# EAGLE design Adafruit TFT 2.8in Resistive Touchshield rev E (EAGLE 9.6.2)
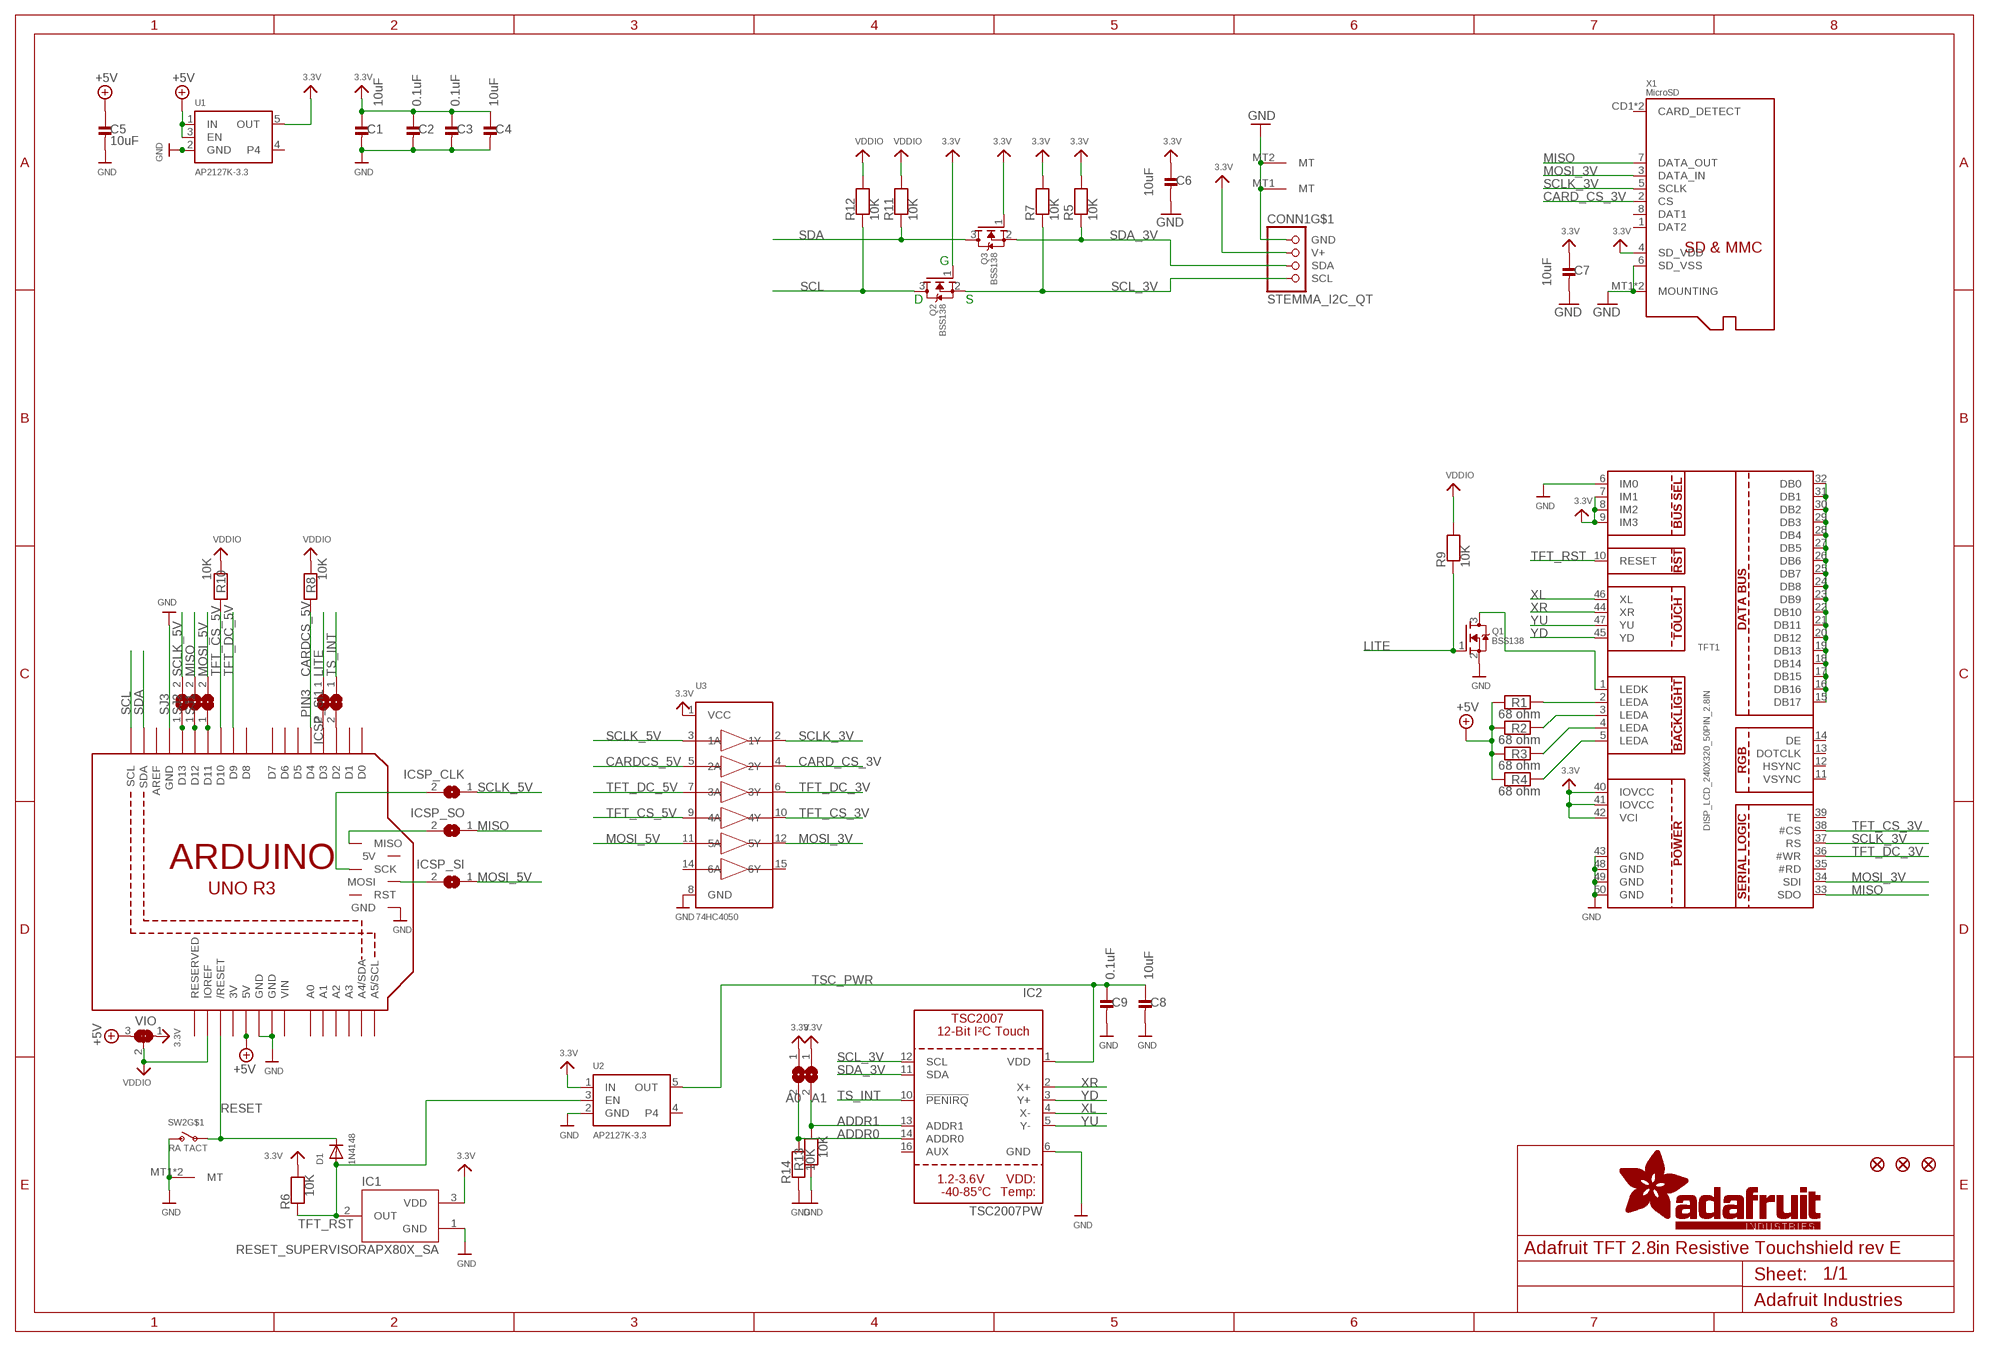
[diagram p0: schematic, sheet 1]

## Parts
ARD  ARDUINO_R3_ICSPSMT  [ARDUINOR3_ICSP_SMT]
C1  10uF  CAP_CERAMIC0805-NOOUTLINE  [0805-NO]
C2  0.1uF  CAP_CERAMIC0603_NO  [0603-NO]
C3  0.1uF  CAP_CERAMIC0603_NO  [0603-NO]
C4  10uF  CAP_CERAMIC0805-NOOUTLINE  [0805-NO]
C5  10uF  CAP_CERAMIC0805-NOOUTLINE  [0805-NO]
C6  10uF  CAP_CERAMIC0805-NOOUTLINE  [0805-NO]
C7  10uF  CAP_CERAMIC0805-NOOUTLINE  [0805-NO]
C8  10uF  CAP_CERAMIC0805-NOOUTLINE  [0805-NO]
C9  0.1uF  CAP_CERAMIC0603_NO  [0603-NO]
CONN1  STEMMA_I2C_QT  [JST_SH4]
D1  1N4148  DIODESOD-323F  [SOD-323F]
IC1  RESET_SUPERVISORAPX80X_SA  [SOT23-WIDE]
IC2  TSC2007PW  [TSSOP16]
ICSP_CLK  SOLDERJUMPERCLOSED  [SOLDERJUMPER_CLOSEDWIRE]
ICSP_CLK1  A1  SOLDERJUMPER  [SOLDERJUMPER_ARROW_NOPASTE]
ICSP_CLK2  A0  SOLDERJUMPER  [SOLDERJUMPER_ARROW_NOPASTE]
ICSP_SI  SOLDERJUMPERCLOSED  [SOLDERJUMPER_CLOSEDWIRE]
ICSP_SI1  SOLDERJUMPERCLOSED  [SOLDERJUMPER_CLOSEDWIRE]
ICSP_SO  SOLDERJUMPERCLOSED  [SOLDERJUMPER_CLOSEDWIRE]
PIN3  SOLDERJUMPER  [SOLDERJUMPER_ARROW_NOPASTE]
Q1  BSS138  MOSFET-NWIDE  [SOT23-WIDE]
Q2  BSS138  MOSFET-NWIDE  [SOT23-WIDE]
Q3  BSS138  MOSFET-NWIDE  [SOT23-WIDE]
R1  68 ohm  RESISTOR_0603_NOOUT  [0603-NO]
R2  68 ohm  RESISTOR_0603_NOOUT  [0603-NO]
R3  68 ohm  RESISTOR_0603_NOOUT  [0603-NO]
R4  68 ohm  RESISTOR_0603_NOOUT  [0603-NO]
R5  10K  RESISTOR_0603_NOOUT  [0603-NO]
R6  10K  RESISTOR_0603_NOOUT  [0603-NO]
R7  10K  RESISTOR_0603_NOOUT  [0603-NO]
R8  10K  RESISTOR_0603_NOOUT  [0603-NO]
R9  10K  RESISTOR_0603_NOOUT  [0603-NO]
R10  10K  RESISTOR_0603_NOOUT  [0603-NO]
R11  10K  RESISTOR_0603_NOOUT  [0603-NO]
R12  10K  RESISTOR_0603_NOOUT  [0603-NO]
R13  10K  RESISTOR_0603_NOOUT  [0603-NO]
R14  10K  RESISTOR_0603_NOOUT  [0603-NO]
SJ1  SOLDERJUMPER  [SOLDERJUMPER_ARROW_NOPASTE]
SJ2  SOLDERJUMPER  [SOLDERJUMPER_ARROW_NOPASTE]
SJ3  SOLDERJUMPER  [SOLDERJUMPER_ARROW_NOPASTE]
SW2  RA TACT  SWITCH_SPST_MNT_TACT_RA  [SPST_TACTILE_RA]
TFT1  DISP_LCD_240X320_50PIN_2.8IN  [TFT_2.83IN_240X320_50PIN]
U1  AP2127K-3.3  VREG_SOT23-5  [SOT23-5]
U2  AP2127K-3.3  VREG_SOT23-5  [SOT23-5]
U3  74HC4050  74HC4050D  [SOIC16]
U$10  FIDUCIAL_1MM  [FIDUCIAL_1MM]
U$11  FIDUCIAL_1MM  [FIDUCIAL_1MM]
U$19  FIDUCIAL_1MM  [FIDUCIAL_1MM]
VIO  SOLDERJUMPER_2WAY  [SOLDERJUMPER_2WAY_OPEN_NOPASTE]
X1  MicroSD  MICROSD  [MICROSD]

## Nets
3.3V: C1.1 C2.1 C3.1 C4.1 C6.1 C7.1 CONN1.2(V+) IC1.3(VDD) ICSP_CLK1.1 ICSP_CLK2.1 Q2.1(G) Q3.1(G) R5.2 R6.2 R7.2 TFT1.7(IM1) TFT1.8(IM2) TFT1.9(IM3) TFT1.40(IOVCC) TFT1.41(IOVCC) TFT1.42(VCI) U1.5(OUT) U2.1(IN) U3.1(VCC) VIO.1 X1.4(SD_VDD)
+5V: ARD.5V C5.1 R1.1 R2.1 R3.1 R4.1 U1.1(IN) U1.3(EN) VIO.3
ADDR0: IC2.14(ADDR0) ICSP_CLK2.2 R14.2
ADDR1: IC2.13(ADDR1) ICSP_CLK1.2 R13.2
BACKLITE: ARD.D3 PIN3.2
CARD_CS_3V: U3.4(2Y) X1.2(CS)
CARDCS_5V: ARD.D4 R8.1 U3.5(2A)
GND: ARD.GND ARD.GND@1(GND) ARD.GND@2(GND) ARD.GND@3(GND) C1.2 C2.2 C3.2 C4.2 C5.2 C6.2 C7.2 C8.2 C9.2 CONN1.1(GND) CONN1.MT1(MT) CONN1.MT2(MT) IC1.1(GND) IC2.6(GND) Q1.2(S) R13.1 R14.1 SW2.2(S) SW2.MT1(MT) SW2.MT2(MT) TFT1.6(IM0) TFT1.43(GND) TFT1.48(GND) TFT1.49(GND) TFT1.50(GND) U1.2(GND) U2.2(GND) U3.8(GND) X1.6(SD_VSS) X1.MT1(MOUNTING) X1.MT2(MOUNTING)
LITE: PIN3.1 Q1.1(G) R9.1
MISO: ICSP_SO.1 SJ2.2 TFT1.33(SDO) X1.7(DATA_OUT)
MOSI_3V: TFT1.34(SDI) U3.12(5Y) X1.3(DATA_IN)
MOSI_5V: ICSP_SI.1 SJ1.2 U3.11(5A)
N$1: Q1.3(D) TFT1.1(LEDK)
N$2: R1.2 TFT1.2(LEDA)
N$3: R2.2 TFT1.3(LEDA)
N$4: R3.2 TFT1.4(LEDA)
N$6: ARD.MOSI ICSP_SI.2
N$8: ARD.D2 ICSP_SI1.2
N$9: TFT1.15(DB17) TFT1.16(DB16) TFT1.17(DB15) TFT1.18(DB14) TFT1.19(DB13) TFT1.20(DB12) TFT1.21(DB11) TFT1.22(DB10) TFT1.23(DB9) TFT1.24(DB8) TFT1.25(DB7) TFT1.26(DB6) TFT1.27(DB5) TFT1.28(DB4) TFT1.29(DB3) TFT1.30(DB2) TFT1.31(DB1) TFT1.32(DB0)
N$10: R4.2 TFT1.5(LEDA)
N$11: ARD.MISO ICSP_SO.2
N$12: ARD.SCK ICSP_CLK.2
N$13: ARD.D13 SJ3.1
N$14: ARD.D12 SJ2.1
N$15: ARD.D11 SJ1.1
RESET: ARD.RESET(/RESET) D1.C SW2.1(P)
SCL: ARD.SCL Q2.3(D) R12.1
SCL_3V: CONN1.4(SCL) IC2.12(SCL) Q2.2(S) R7.1
SCLK_3V: TFT1.37(RS) U3.2(1Y) X1.5(SCLK)
SCLK_5V: ICSP_CLK.1 SJ3.2 U3.3(1A)
SDA: ARD.SDA Q3.3(D) R11.1
SDA_3V: CONN1.3(SDA) IC2.11(SDA) Q3.2(S) R5.1
TFT_CS_3V: TFT1.38(#CS) U3.10(4Y)
TFT_CS_5V: ARD.D10 R10.1 U3.9(4A)
TFT_DC_3V: TFT1.36(#WR) U3.6(3Y)
TFT_DC_5V: ARD.D9 U3.7(3A)
TFT_RST: D1.A IC1.2(OUT) R6.1 TFT1.10(RESET) U2.3(EN)
TS_INT: IC2.10(!PENIRQ) ICSP_SI1.1
TSC_PWR: C8.1 C9.1 IC2.1(VDD) U2.5(OUT)
VDDIO: ARD.IOREF R8.2 R9.2 R10.2 R11.2 R12.2 VIO.2
XL: IC2.4(X-) TFT1.46(XL)
XR: IC2.2(X+) TFT1.44(XR)
YD: IC2.3(Y+) TFT1.45(YD)
YU: IC2.5(Y-) TFT1.47(YU)
Unconnected: ARD.5V_ICSP(5V) ARD.A0 ARD.A1 ARD.A2 ARD.A3 ARD.A4(A4/SDA) ARD.A5(A5/SCL) ARD.AREF ARD.D0 ARD.D1 ARD.D5 ARD.D6 ARD.D7 ARD.D8 ARD.RESERVED ARD.RESET_ICSP(RST) IC2.16(AUX) TFT1.11(VSYNC) TFT1.12(HSYNC) TFT1.13(DOTCLK) TFT1.14(DE) TFT1.35(#RD) TFT1.39(TE) U1.4 U2.4 U3.14(6A) U3.15(6Y) X1.1(DAT2) X1.8(DAT1) X1.CD1(CARD_DETECT) X1.CD2(CARD_DETECT)

## Notes on the sheet
- G
- D | S

## Power pins joined to a net without a drawn wire
3V: ARD.3V
VIN: ARD.VIN

## Library data of the parts
ARD = adafruit_micro:ARDUINO_R3_ICSP
C1-C9 = microbuilder:CAP_CERAMIC: Ceramic Capacitors For new designs, use the packages preceded by an '_' character since they are more reliable: The following footprints should be used on most boards: _0402 - Standard footprint for regular board layouts _0603 - Standard footprint for regular board layouts _0805 - Standard footprint for regular board layouts _1206 - Standard footprint for regular board layouts For extremely tight-pitch boards where space is at a premium, the following 'micro-pitch' footprints can be used (smaller pads, no silkscreen outline, etc.): _0402MP - Micro-pitch footprint for very dense/compact boards _0603MP - Micro-pitch footprint for very dense/compact boards _0805MP - Micro-pitch footprint for very dense/compact boards _1206MP - Micro-pitch footprint for very dense/compact boards
CONN1 = adafruit_electromech:STEMMA_I2C; LCSC: C2845363
D1 = adafruit:DIODE: Diode SMADIODE - SMA Surface Mount Package 20V 1A Schottky Diode Digikey: 641-1014-6-ND DO-1N4148 - Through Hole Small Current Diode SOD-123 20V 1 A (.5mV Vf) Schottky Diode - Digikey: MBRX120TPMSCT-ND SOD-323 10V 570mA (.38mV Vf, 3ns) Schottky Diode - Digikey: ZLLS410CT-ND SOD-523 30V 30mA Schottky Diode (RB751S-40TE61) - Digikey: RB751S-40TE61CT-ND SOT23-R/W - SOT23 Package (R = Solder Paste/Reflow Ovens, W = Hand-Soldering) BAT54Film 40V 300mA - Digikey: 497-7162-1-ND
IC1 = adafruit_power:RESET_SUPERVISOR; ROT: 270
IC2 = adafruit_sensor:TSC2007
ICSP_CLK ICSP_SI ICSP_SI1 ICSP_SO = microbuilder:SOLDERJUMPER: SMD Solder JUMPER Solder the two pads together to create a connection, or remove the solder to break it. REFLOW - Use this footprint for solder paste and reflow ovens. WAVE - Use this footprint for hand-soldering (larger pads). CLOSED - Has a trace between the two pads to ensure it is closed by default. The trace needs to be cut to disable the jumper, and can be closed again by creating a solder bridge between the two pads.
ICSP_CLK1 ICSP_CLK2 PIN3 SJ1-SJ3 = microbuilder:SOLDERJUMPER: SMD Solder JUMPER Solder the two pads together to create a connection, or remove the solder to break it. REFLOW - Use this footprint for solder paste and reflow ovens. WAVE - Use this footprint for hand-soldering (larger pads). CLOSED - Has a trace between the two pads to ensure it is closed by default. The trace needs to be cut to disable the jumper, and can be closed again by creating a solder bridge between the two pads.; BOM: EXCLUDE
Q1-Q3 = microbuilder:MOSFET-N: N-Channel Mosfet LEGEND VDS: Voltage Drain-Source ID: Drain Current RDS(ON): Drain-Source On-State Resistance VGS(TH): Gate-Source Threshold Voltage CISS: Drain-Source Input Capacitance SOT-23 Name VDS ID RDS(ON) VGS(TH) CISS Order Number 2N7002E 60V 260mA 2.5 Ohm 2.5V @ 250uA 26.7pF @ 25V 2N7002ET1GOSTR-ND BSH103 30V 850mA 400 mOhm 400mV @ 1mA 83pF @ 24V BSH103,235-ND BSS138 60V 320mA 1.6 Ohm 1.5V @ 250uA 50pF @ 10V Mouser: 771-BSS138PW115 DMN2075U-7 20V 4.2A 38 mOhm 1V @ 250 uA 594.3pF @ 10V DMN2075U-7DICT-ND * BSS138 good choice for I2C level-shifting POWERPAK 1212-8 Name VDS ID RDS(ON) VGS(TH) CISS Order Number Si7308DN 60V 6A 58 mOhm 3V @ 250uA 665pF @ 15V SI7308DN-T1-E3CT-ND
R1-R14 = microbuilder:RESISTOR: Resistors For new designs, use the packages preceded by an '_' character since they are more reliable: The following footprints should be used on most boards: _0402 - Standard footprint for regular board layouts _0603 - Standard footprint for regular board layouts _0805 - Standard footprint for regular board layouts _1206 - Standard footprint for regular board layouts For extremely tight-pitch boards where space is at a premium, the following 'micro-pitch' footprints can be used (smaller pads, no silkscreen outline, etc.): _0402MP - Micro-pitch footprint for very dense/compact boards _0603MP - Micro-pitch footprint for very dense/compact boards _0805MP - Micro-pitch footprint for very dense/compact boards _1206MP - Micro-pitch footprint for very dense/compact boards
SW2 = adafruit_electromech:SWITCH_SPST_MNT: Switch - SPST 4UCon 19192 (6.7x2.6mm SMT); LCSC: C778159
TFT1 = adafruit_display:DISP_LCD_240X320_50PIN
U1 U2 = adafruit_power:VREG_SOT23-5: SOT23-5 Fixed Voltage Regulators Part Current Out V Out V In V Dropout θJA (°C/W) TJ (°C) Digikey Part No. ADP121 150mA 3.3V 3.4-5.5V 0.09V @ 150mA -- -- ADP121-AUJZ33R7CT-ND ADP121 150mA 3.0V 3.1-5.5V 0.09V @ 150mA -- -- ADP121-AUJZ30R7CT-ND ADP122 300mA 3.3V 3.4-5.5V 0.085V @ 300mA -- -- ADP122AUJZ-3.3-R7CT-ND ADP1712 300mA 3.3V 3.5-5.5V 0.17V @ 300mA -- -- ADP1712AUJZ-3.3-R7TR-ND AP7311 (Low Cost) 150mA 3.3V 3.5-6V 0.15V @ 150mA -- -- AP7311-33WG-7DICT-ND LD39015M18R 150mA 1.8V 1.9V-5.5V 0.08V @ 100mA -- -- 497-6977-1-ND LP2985A-33DBVR 150mA 3.3V 3.3-16V 0.28V @ 150mA 206 150 296-18479-1-ND MCP1824T-3302E/OT 300mA 3.3V 3.5V-6V 0.2V @ 300mA -- -- MCP1824T-3302E/OTCT-ND MIC5205-2.5YM5 TR 150mA 2.5V 2.7-16V 0.165V @ 150mA -- -- 576-1257-2-ND MIC5205-3.0YM5 TR 150mA 3.0V 3.2V-16V 0.165V @ 150mA -- -- 576-1258-2-ND MIC5205-3.3YM5 TR 150mA 3.3V 3.5V-16V 0.165V @ 150mA -- -- 576-1259-2-ND TPS780330220 150mA 3.3V+2.2V 3.6-5.5V 250mV Max -- -- 296-23332-1-ND TDA3663/N1,135 100mA 3.3V 3.5-45V 0.18V @ 50mA -- -- 568-5343-1-ND Max operating temp can be calculated using θJA, TJ (max junction temperature), and power in watts. Set the "Maximum Ambient Temperature" until it reaches TJ ("Max Junction Temperature"), which is the absolute limit for safe use of the regulator: Heat Sink Temperature Calculator <http://www.daycounter.com/Calculators/Heat-Sink-Temperature-Calculator.phtml> For example, With 12V source into a 3.3V LP2985 and a 30mA load, we are dissipating (12V-3.3V) * 0.03A = 0.261W. With a θJA of 206 °C/W, a TJ of 150°C, and 261mW we can safely use the chip without a heat sink up to 75°C (=147.1°C Junction Temperature).; JLC_ROTATION: 270
U3 = microbuilder:74HC4050D: 6-channel level shifter 74HC4050D - 2V-6V Supply SOIC16 Digikey: 74HC4050D,653-ND Mouser: 771-74HC4050D-T TSSOP16 Digikey: 296-9215-1-ND Mouser:
U$10 U$11 U$19 = microbuilder:FIDUCIAL: Fiducial Alignment Points Various fiducial points for machine vision alignment.; BOM: EXCLUDE
VIO = microbuilder:SOLDERJUMPER_2WAY: 2-Way Solder Jumper
X1 = adafruit_electromech:MICROSD: MicroSD/Transflash Card Holder with SPI pinout 3M: 2908-05WB-MG 4UConnector: 19656 Footprint courtesy: Adafruit Industries; JLC_ROTATION: 90; LCSC: C125617

## Net classes
1 highpower: width 0.305 mm, drill 0.483 mm
2 lowpower: width 0.254 mm, drill 0.483 mm

## Board
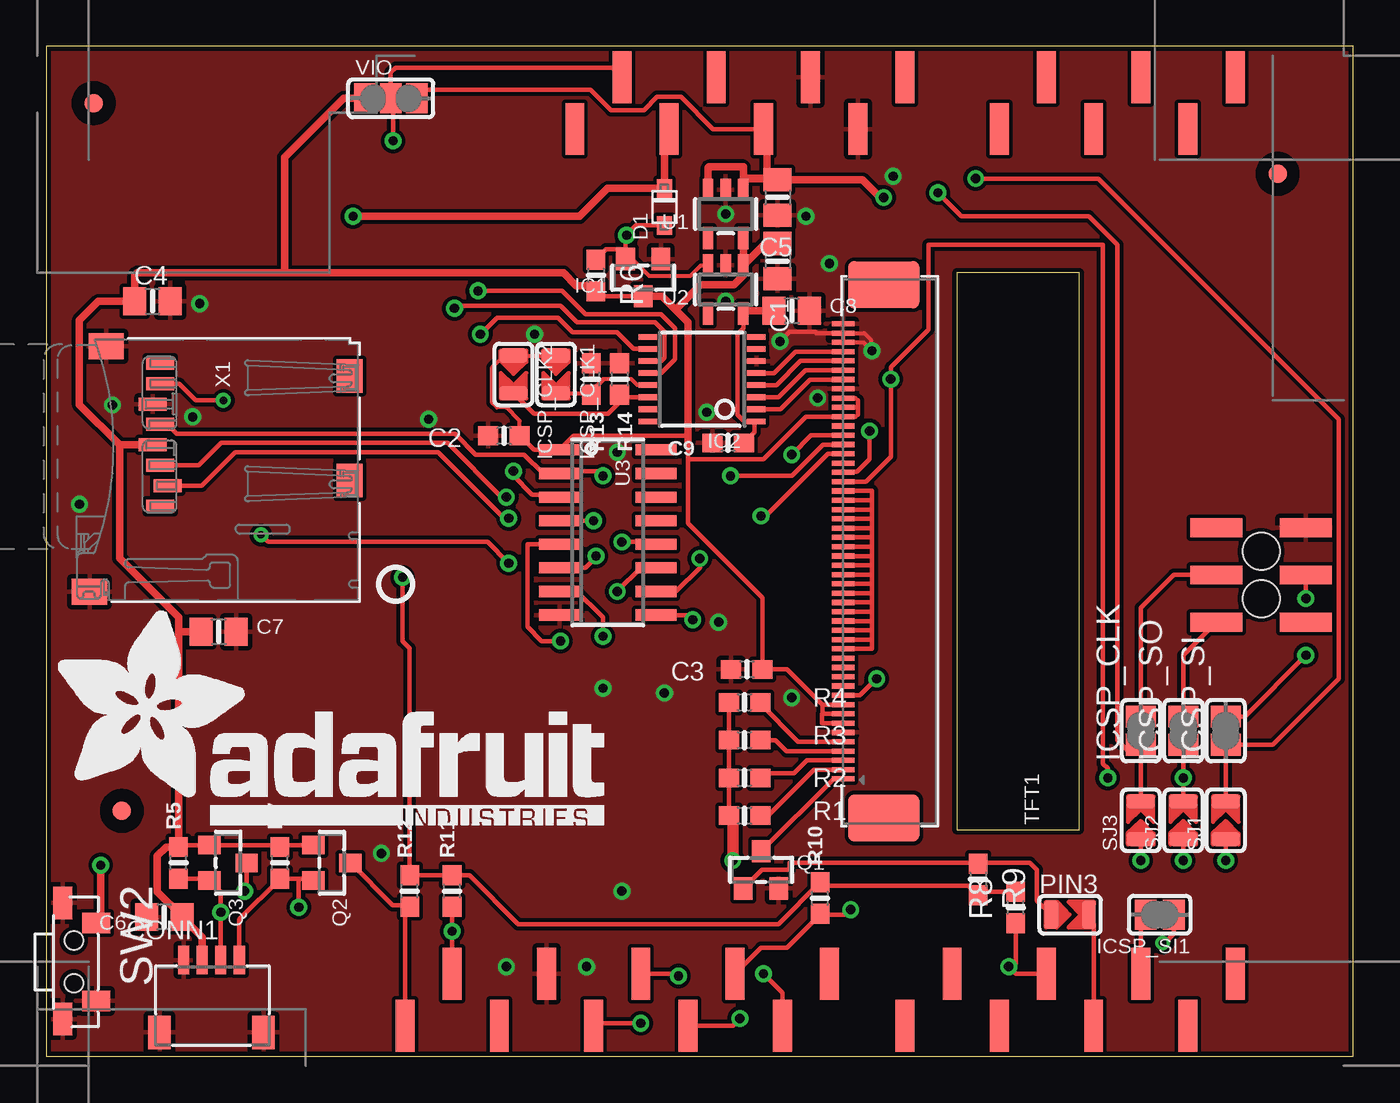
[diagram p1: board, top side]
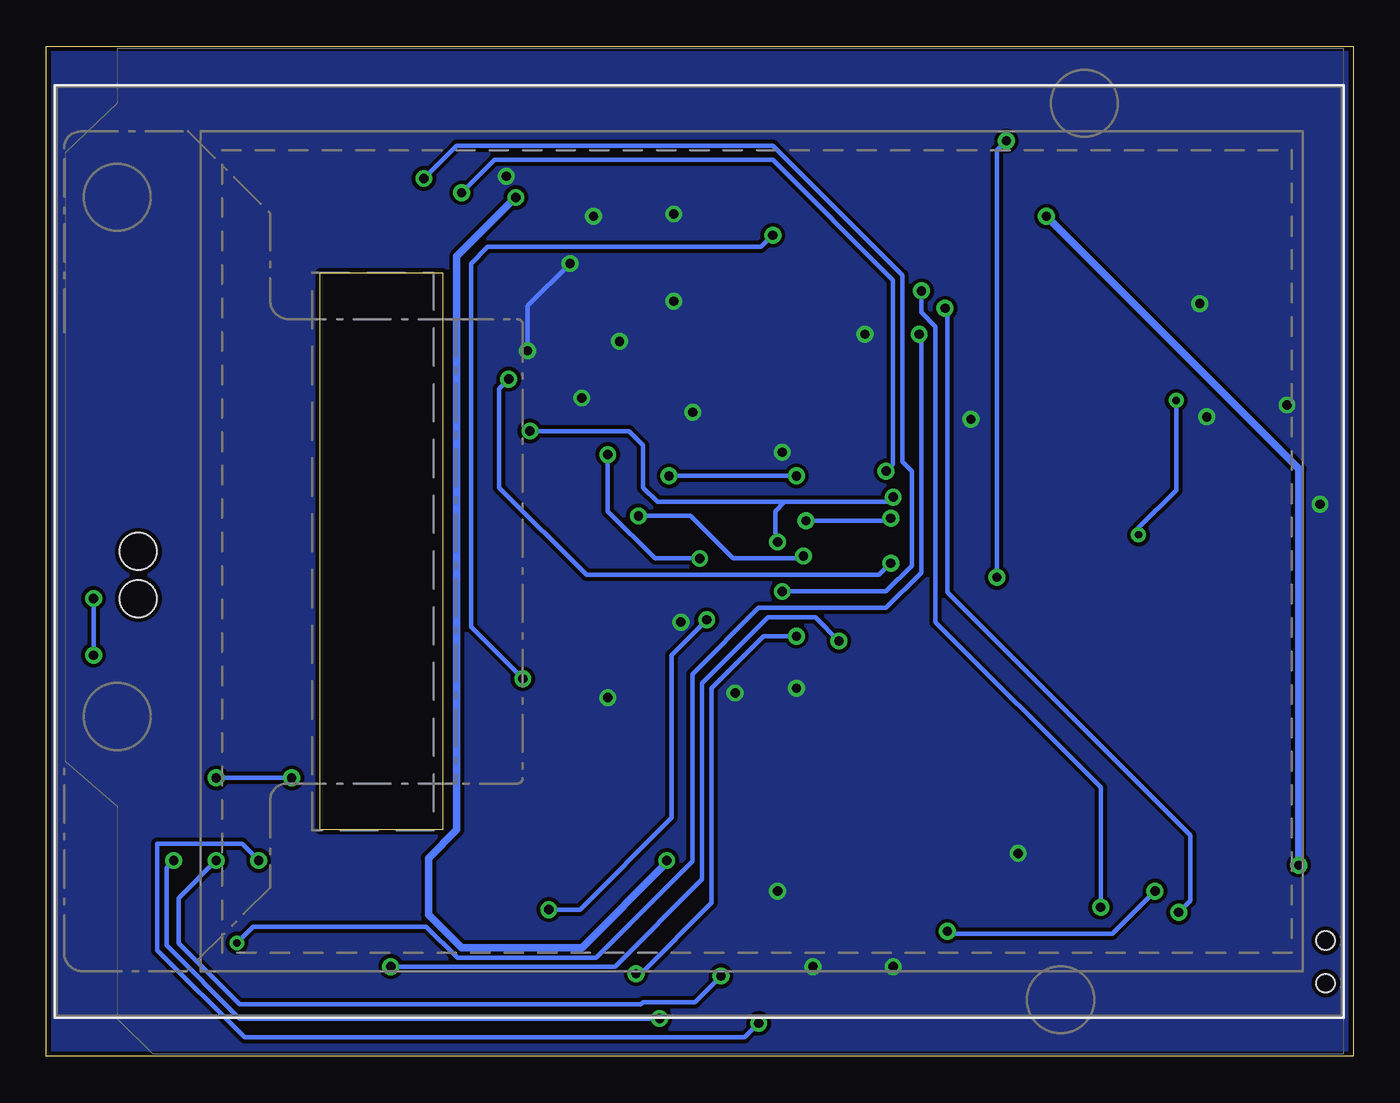
[diagram p2: board, bottom side, seen from below]

Size 70.36 x 54.36 mm. Coordinates in mm from the lower left corner, seen from the top.
Outline: 0,54.36 0,0 70.36,0 70.36,54.36 0,54.36
Outline: 49.02,42.16 49.02,12.19 55.63,12.19 55.63,42.16 49.02,42.16
Copper layers (1*16): Top 0.035mm / dielectric 1.5mm / Bottom 0.035mm
Design rules "adafruit": minimum track width 8mil, minimum drill 15.5mil, track to track 8mil, track to pad 8mil, pad to pad 8mil, via to via 8mil, smd to smd 8mil, copper to edge 10mil, drill to drill 8mil, minimum pad ring 10mil, minimum via ring 8mil, stop-mask expansion 4mil, vias tented up to drill 20mil, thermal gap 10mil
tRestrict: area 42.2,38.6 to 42.7,38.7; area 42.3,39.1 to 42.5,39.2

### Footprints (pad centres in the part's own frame; a part is rotated, then mirrored left to right if it is on the bottom)
ARDUINOR3_ICSP_SMT = smd 1.016 x 2.794 bottom: 3V 35.56,1.143; 5V 38.1,3.937; A0 50.8,3.937; A1 53.34,1.143; A2 55.88,3.937; A3 58.42,1.143; A4 60.96,3.937; A5 63.5,1.143; AREF 23.876,52.197; D0 63.5,49.403; D1 60.96,52.197; D2 58.42,49.403; D3 55.88,52.197; D4 53.34,49.403; D5 50.8,52.197; D6 48.26,49.403; D7 45.72,52.197; D8 41.656,49.403; D9 39.116,52.197; D10 36.576,49.403; D11 34.036,52.197; D12 31.496,49.403; D13 28.956,52.197; GND 26.416,49.403; GND@1 43.18,3.937; GND@2 40.64,1.143; IOREF 30.48,1.143; RESERVED 27.94,3.937; RESET 33.02,3.937; SCL 18.796,52.197; SDA 21.336,49.403; VIN 45.72,1.143 | smd 2.794 x 1.016 bottom: 5V_ICSP 67.31,30.48; GND@3 67.31,25.4; MISO 62.484,30.48; MOSI 67.31,27.94; RESET_ICSP 62.484,25.4; SCK 62.484,27.94 | hole 2: 64.897,29.21; 64.897,26.67
0805-NO = smd 1.24 x 1.5: 1 -0.95,0; 2 0.95,0
0603-NO = smd 1.075 x 1: 1 -0.85,0; 2 0.85,0
JST_SH4 = smd 0.6 x 1.55: 1 -1.5,2.006; 2 -0.5,2.006; 3 0.5,2.006; 4 1.5,2.006 | smd 1.2 x 1.8: MT1 -2.8,-1.894; MT2 2.8,-1.894
SOD-323F = smd 1 x 0.8: A -1,0; C 1,0
SOT23-WIDE = smd 1 x 1.2: 1 -0.95,-1; 2 0.95,-1; 3 0,1
TSSOP16 = smd 0.305 x 0.991: 1 -2.275,-2.918; 2 -1.625,-2.918; 3 -0.975,-2.918; 4 -0.325,-2.918; 5 0.325,-2.918; 6 0.975,-2.918; 7 1.625,-2.918; 8 2.275,-2.918; 9 2.275,2.918; 10 1.625,2.918; 11 0.975,2.918; 12 0.325,2.918; 13 -0.325,2.918; 14 -0.975,2.918; 15 -1.625,2.918; 16 -2.275,2.918
SOLDERJUMPER_CLOSEDWIRE = smd 1.168 x 1.6: 1 -0.762,0; 2 0.762,0 | smd 0.635 x 0.203: WIRE 0,0
SOLDERJUMPER_ARROW_NOPASTE = smd 0.762 x 1.524: 1 -1.016,0; 2 1.016,0
SPST_TACTILE_RA = smd 1.1 x 1.5: 1 2.1,-0.9; 2 -2.1,-0.9 | smd 1.75 x 1: MT1 3.175,0.9; MT2 -3.075,0.9 | hole 1: 1.15,0.3; -1.15,0.3
TFT_2.83IN_240X320_50PIN = smd 0.275 x 1.2 bottom: 1 12.25,1.04; 2 11.75,1.04; 3 11.25,1.04; 4 10.75,1.04; 5 10.25,1.04; 6 9.75,1.04; 7 9.25,1.04; 8 8.75,1.04; 9 8.25,1.04; 10 7.75,1.04; 11 7.25,1.04; 12 6.75,1.04; 13 6.25,1.04; 14 5.75,1.04; 15 5.25,1.04; 16 4.75,1.04; 17 4.25,1.04; 18 3.75,1.04; 19 3.25,1.04; 20 2.75,1.04; 21 2.25,1.04; 22 1.75,1.04; 23 1.25,1.04; 24 0.75,1.04; 25 0.25,1.04; 26 -0.25,1.04; 27 -0.75,1.04; 28 -1.25,1.04; 29 -1.75,1.04; 30 -2.25,1.04; 31 -2.75,1.04; 32 -3.25,1.04; 33 -3.75,1.04; 34 -4.25,1.04; 35 -4.75,1.04; 36 -5.25,1.04; 37 -5.75,1.04; 38 -6.25,1.04; 39 -6.75,1.04; 40 -7.25,1.04; 41 -7.75,1.04; 42 -8.25,1.04; 43 -8.75,1.04; 44 -9.25,1.04; 45 -9.75,1.04; 46 -10.25,1.04; 47 -10.75,1.04; 48 -11.25,1.04; 49 -11.75,1.04; 50 -12.25,1.04 | smd 2.54 x 3.81 bottom: PAD1 14.35,-1.152; PAD2 -14.35,-1.152
SOT23-5 = smd 0.55 x 1.2: 1 -0.95,-1.3; 2 0,-1.3; 3 0.95,-1.3; 4 0.95,1.3; 5 -0.95,1.3
SOIC16 = smd 0.6 x 2.2: 1 -4.445,-2.6; 2 -3.175,-2.6; 3 -1.905,-2.6; 4 -0.635,-2.6; 5 0.635,-2.6; 6 1.905,-2.6; 7 3.175,-2.6; 8 4.445,-2.6; 9 4.445,2.6; 10 3.175,2.6; 11 1.905,2.6; 12 0.635,2.6; 13 -0.635,2.6; 14 -1.905,2.6; 15 -3.175,2.6; 16 -4.445,2.6
FIDUCIAL_1MM = smd 1 x 1: 1 0,0
SOLDERJUMPER_2WAY_OPEN_NOPASTE = smd 1.168 x 1.6: 1 -1.397,0; 2 0,0; 3 1.397,0
MICROSD = smd 0.7 x 1.5: 1 1.761,-3.147; 2 0.661,-2.747; 3 -0.439,-3.147; 4 -1.539,-3.547; 5 -2.639,-3.147; 6 -3.739,-3.547; 7 -4.839,-3.147; 8 -5.939,-3.147 | smd 1.8 x 1.4: CD1 -5.239,7.053; CD2 0.38,7.053 | smd 1.4 x 1.9: MT1 -6.839,-6.047; MT2 6.361,-6.947

### Placement (x,y rotation side)
ARD  0.51,53.85 180 bottom
C1  39.37,42.8 270 top
C2  24.64,33.4 180 top
C3  37.72,20.83 180 top
C4  5.71,40.64 0 top
C5  39.37,46.23 270 top
C6  6.35,7.49 180 top
C7  9.27,22.86 0 top
C8  40.13,40.13 0 top
C9  36.7,33.02 180 top
CONN1  8.89,3.17 0 top
D1  33.27,45.72 90 top
IC1  32.13,41.91 180 top
IC2  35.31,36.45 90 top
ICSP_CLK  58.93,17.53 90 top
ICSP_CLK1  27.43,36.7 270 top
ICSP_CLK2  25.15,36.7 270 top
ICSP_SI  63.5,17.53 90 top
ICSP_SI1  59.94,7.62 180 top
ICSP_SO  61.21,17.53 90 top
PIN3  55.12,7.62 0 top
PLABEL0  [PLABEL0]  55.12,9.53 0 top
PLABEL1  [PLABEL1]  1.4,47.37 0 top
PLABEL2  [PLABEL2]  1.27,44.7 0 top
PLABEL3  [PLABEL3]  1.27,42.16 0 top
PLABEL4  [PLABEL4]  60.45,15.62 0 top
PLABEL5  [PLABEL5]  60.33,14.61 0 top
PLABEL6  [PLABEL6]  62.74,14.61 0 top
PLABEL7  [PLABEL7]  59.94,19.56 0 top
PLABEL8  [PLABEL8]  57.15,12.7 90 top
PLABEL9  [PLABEL9]  65.28,12.7 90 top
PLABEL10  [PLABEL10]  58.04,29.72 0 top
PLABEL11  [PLABEL11]  46.23,43.94 0 top
PLABEL12  [PLABEL12]  69.22,9.65 90 top
PLABEL13  [PLABEL13]  4.7,1.78 90 top
PLABEL14  [PLABEL14]  57.78,8.89 0 top
PLABEL15  [PLABEL15]  60.83,5.21 0 top
PLABEL16  [PLABEL16]  55.24,5.21 0 top
PLABEL17  [PLABEL17]  15.49,51.69 90 top
PLABEL18  [PLABEL18]  21.59,51.69 90 top
PLABEL19  [PLABEL19]  18.54,53.34 0 top
PLABEL20  [PLABEL20]  14.1,5.84 0 top
PLABEL21  [PLABEL21]  25.02,41.02 90 top
PLABEL22  [PLABEL22]  27.43,41.02 90 top
Q1  38.48,10.03 0 top
Q2  15.37,10.41 270 top
Q3  9.78,10.41 270 top
R1  37.59,12.95 0 top
R2  37.59,14.99 0 top
R3  37.59,17.02 0 top
R4  37.59,19.05 0 top
R5  7.11,10.41 90 top
R6  29.59,42.04 270 top
R7  12.57,10.41 90 top
R8  52.2,8 90 top
R9  50.16,9.53 270 top
R10  41.66,8.51 90 top
R11  21.84,8.89 90 top
R12  19.56,8.89 90 top
R13  29.34,36.45 270 top
R14  30.86,36.45 270 top
SJ1  63.5,12.7 90 top
SJ2  61.21,12.7 90 top
SJ3  58.93,12.7 90 top
SW2  1.78,5.08 90 top
TFT1  43.94,27.18 270 bottom
U1  36.58,45.34 180 top
U2  36.58,41.27 180 top
U3  30.23,28.19 270 top
U$3  [PCBFEAT-REV-040]  18.8,25.4 0 top
U$10  66.29,47.5 180 top
U$11  4.06,13.21 180 top
U$19  2.54,51.31 0 top
U$20  [ADAFRUIT_TEXT_30MM]  0.38,12.45 0 top
VIO  18.54,51.56 0 top
X1  9.27,31.37 270 top

### Tracks (layer width: path | path; a pad name or v marks a point on that pad's centre or on a via)
3.3V
  Top 0.203: ICSP_CLK1.1 ICSP_CLK2.1 24.64,37.72 24,37.08 24,35.18 24.26,34.92 24.77,34.92 25.49,34.2 C2.1
  Top 0.254: TFT1.42 43.57,35.43 43.69,35.31 43.69,34.92 | 43.69,34.92 43.69,34.54 43.56,34.42 42.91,34.42 TFT1.40 40.91,34.43 38.61,32.13 34.54,32.13 | TFT1.41 43.69,34.93 43.69,34.92 | TFT1.9 41.78,18.93 | 41.78,18.93 39.88,20.83 C3.1 38.57,24.68 34.54,28.7 34.54,32.13 | 41.78,18.43 41.78,18.93 | TFT1.8 41.78,18.43 | 41.78,18.43 41.76,18.43 41.76,17.93 TFT1.7 | IC1.3 29.61,40.91 29.29,41.23 29.04,41.48 | 29.55,41.23 R6.2 | R5.2 7.21,11.36 Q3.1 12.47,11.36 R7.2 12.67,11.36 Q2.1 | 34.54,33.53 34.42,33.4 28.39,33.4 U3.1 26.25,32.64 C2.1 | 34.54,33.02 34.54,32.51 34.54,32.13
  Top 0.406: 33.88,40.18 34.54,39.51 34.54,33.53 34.54,33.02 | 33.88,40.18 33.15,40.91 IC1.3 | CONN1.2 8.39,6.4 C6.1 7.3,7.54 5.97,8.87 5.97,10.79 6.44,11.26 R5.2 7.11,22.86 | 7.11,22.86 7.11,23.62 3.94,26.8 3.94,32.91 | C7.1 7.11,22.86 | 3.94,32.91 X1.4 | 3.94,32.91 1.78,35.07 1.78,39.62 2.79,40.64 C4.1 4.76,42.04 4.89,42.16 12.83,42.16 | 12.83,42.16 27.85,42.16 28.53,41.48 29.04,41.48 | 29.29,41.23 29.55,41.23 | 12.83,42.16 12.83,48.39 16,51.56 VIO.1 | U1.5 U2.1 | U2.1 37.53,42.04 37.02,41.53 35.22,41.53 33.88,40.18 | C1.1 38.7,43.75 U2.1
+5V  (via drill 0.5)
  Top 0.254: R1.1 R2.1 R3.1 R4.1 | VIO.3 19.94,51.65 20.31,52.02 29.3,52.02 30.39,50.93 32.17,50.93 32.88,51.64 34.17,51.64 35.9,49.91 ARD.5V
  Top 0.406: v45.09,46.23 44.89,46.23 43.94,47.18 C5.1 39.27,47.27 37.78,47.27 37.53,47.02 U1.1 37.53,47.24 | ARD.5V 38.61,49.15 38.8,48.96 38.8,47.24 37.53,47.24 | 37.53,47.24 37.53,47.88 35.69,47.88 35.63,47.82 U1.3
  Top 0.61: R1.1 36.96,12.74 v36.96,10.54
  Bottom 0.406: v36.96,10.54 36.96,10.41 41.53,5.84 48.01,5.84 49.78,7.62 49.78,10.67 48.26,12.19 48.26,43.05 v45.09,46.23
ADDR0
  Top 0.254: ICSP_CLK2.2 26.25,34.59 30.23,34.59 30.99,35.34 30.99,35.47 | IC2.14 30.99,35.47 | 30.99,35.47 R14.2
ADDR1
  Top 0.203: IC2.13 31.82,36.12 31.5,36.45 29.99,36.45 | R13.2 29.1,35.83 28.96,35.69 ICSP_CLK1.2
  Top 0.254: 29.99,36.45 29.34,35.79 R13.2
BACKLITE
  Top 0.254: PIN3.2 56.39,7.11 ARD.D3
CARD_CS_3V  (via drill 0.5)
  Top 0.254: X1.2 8.36,30.71 10.16,32.51 21.08,32.51 24.64,28.96 v24.89,28.96 | v29.46,28.83 U3.4
  Bottom 0.254: v29.46,28.83 25.02,28.83 v24.89,28.96
CARDCS_5V  (via drill 0.5)
  Top 0.254: U3.5 25.91,27.56 25.91,23.11 26.67,22.35 v27.69,22.35 | ARD.D4 52.2,4.45 v51.82,4.83 52.03,4.83 52.2,4.99 R8.1
  Bottom 0.254: v27.69,22.35 28.96,23.62 31.5,23.62 35.05,20.07 35.05,9.53 39.75,4.83 v51.82,4.83
GND  (via drill 0.5)
  Top 0.203: 44.39,38.04 43.99,38.43 TFT1.48 TFT1.49 44.01,38.93 44.02,38.94 44.39,38.57 44.39,38.04 | 44.39,38.04 v44.45,37.97
  Top 0.254: TFT1.49 41.46,38.93 41.4,38.99 40.01,38.99 v39.5,38.48
  Bottom 0.254: v44.45,37.97 44.45,40.39 v42.16,42.67
  other vias: 36.58,45.34 33.27,19.56 29.97,19.81 3.56,35.05 1.78,29.72 41.53,35.43 29.08,4.83 24.77,4.83 30.99,8.89 18.03,10.92 40.13,19.3 36.2,23.37 30.73,32.51 7.87,34.42 20.57,34.29 8.26,40.51 40.89,45.21 45.59,47.37 26.29,38.86 35.56,34.67 36.58,40.64
  pour Top (isolate 0.203): 0,0 0,54.36 71.12,54.36 71.12,0
  pour Bottom (isolate 0.203): 0,0 0,54.36 71.12,54.36 71.12,0
LITE
  Top 0.254: 50.2,10.41 52.96,10.41 53.34,10.03 53.34,8.38 PIN3.1 | 50.2,10.41 40.01,10.41 40.01,10.03 38.53,10.03 Q1.1 | R9.1 50.2,10.41
MISO  (via drill 0.39, 0.5)
  Top 0.254: TFT1.33 44.14,30.93 45.47,32.26 v45.47,36.45 45.47,37.08 47.5,39.12 47.5,43.69 56.9,43.69 56.9,15.75 57.15,15.49 v57.15,14.99 | v24.89,26.54 23.75,27.69 11.94,27.69 v11.56,28.07 | v9.53,35.31 8.04,35.31 7.14,36.21 X1.7 | ICSP_SO.1 v61.21,14.99 SJ2.2
  Bottom 0.254: v57.15,14.99 v61.21,14.99 | v24.89,26.54 25.53,25.91 41.27,25.91 45.97,30.61 45.97,35.94 v45.47,36.45 | v9.53,35.31 9.53,30.48 11.56,28.45 v11.56,28.07
MOSI_3V  (via drill 0.5)
  Top 0.254: U3.12 32.7,27.69 v30.99,27.69 | X1.3 8.19,31.81 9.4,33.02 21.59,33.02 24.51,30.1 v24.77,30.1 | TFT1.34 42.93,31.46 43.64,31.46 44.32,32.15 v44.32,33.66
  Bottom 0.254: 30.61,29.84 31.11,29.34 31.11,27.81 v30.99,27.69 | v24.77,30.1 25.02,29.84 30.61,29.84 | v44.32,33.66 38.99,33.66 38.23,32.89 38.23,30.61 37.47,29.84 30.61,29.84
MOSI_5V  (via drill 0.5)
  Top 0.254: SJ1.2 ICSP_SI.1 66.04,16.76 69.6,20.32 69.6,34.29 56.64,47.24 v50.04,47.24 | v30.73,25.02 32,26.29 U3.11
  Bottom 0.254: v50.04,47.24 48.26,49.02 31.24,49.02 24.26,42.04 24.26,32 23.75,31.5 23.75,26.42 25.15,25.02 v30.73,25.02
N$1
  Top 0.254: TFT1.1 42.79,14.93 42.37,14.93 Q1.3
N$2
  Top 0.254: TFT1.2 41.34,15.43 38.86,12.95 R1.2
N$3
  Top 0.254: TFT1.3 40.95,15.93 40.26,15.24 38.8,15.24 R2.2
N$4
  Top 0.254: TFT1.4 39.85,16.43 39.26,17.02 R3.2
N$6  (via drill 0.5)
  Top 0.254: ICSP_SI.2 64.52,18.29 v67.82,21.59 | v67.82,24.64 ARD.MOSI
  Bottom 0.254: v67.82,21.59 v67.82,24.64
N$8
  Top 0.254: ARD.D2 58.93,7.37 ICSP_SI1.2
N$9
  Top 0.254: TFT1.15 44.45,21.93 44.45,22.43 | 44.45,22.43 44.45,22.93 | 44.45,22.93 44.45,23.43 | 44.45,23.43 44.45,23.93 | 44.45,23.93 44.45,24.43 | 44.45,24.93 44.45,25.43 | 44.45,25.43 44.45,25.93 | 44.45,25.93 44.45,26.43 | 44.45,26.43 44.45,26.93 | 44.45,26.93 44.45,27.43 | 44.45,27.43 44.45,27.93 | 44.45,27.93 44.45,28.43 | 44.45,28.43 44.45,28.93 | 44.45,28.93 44.45,29.43 | 44.45,29.43 44.45,29.93 | 44.45,29.93 44.45,30.43 TFT1.32 | TFT1.31 44.45,29.93 | TFT1.30 44.45,29.43 | TFT1.29 44.45,28.93 | TFT1.28 44.45,28.43 | TFT1.27 44.45,27.93 | TFT1.26 44.45,27.43 | TFT1.25 44.45,26.93 | TFT1.24 44.45,26.43 | TFT1.23 44.45,25.93 | TFT1.22 44.45,25.43 | TFT1.21 44.45,24.93 | 44.45,24.93 44.45,24.43 | TFT1.20 44.45,24.43 | TFT1.19 44.45,23.93 | TFT1.18 44.45,23.43 | TFT1.17 44.45,22.93 | TFT1.16 44.45,22.43
N$10
  Top 0.254: TFT1.5 40.48,16.93 38.44,18.96 R4.2
N$11
  Top 0.254: ICSP_SO.2 61.21,21.59 ARD.MISO
N$12
  Top 0.254: ICSP_CLK.2 58.93,24.13 60.71,25.91 ARD.SCK
N$13  (via drill 0.5)
  Top 0.254: ARD.D13 29.59,1.78 v32,1.78 | SJ3.1 v58.93,10.54
  Bottom 0.254: v32,1.78 32.77,1.02 59.69,1.02 64.39,5.71 64.39,11.43 59.82,11.43 v58.93,10.54
N$14  (via drill 0.5)
  Top 0.254: SJ2.1 v61.21,10.54 | v34.04,4.32 33.91,4.45 ARD.D12
  Bottom 0.254: v61.21,10.54 63.25,8.51 63.25,6.1 59.94,2.79 38.35,2.79 38.23,2.92 35.43,2.92 v34.04,4.32
N$15  (via drill 0.5)
  Top 0.254: SJ1.1 v63.5,10.54 | v37.34,2.03 36.96,1.65 ARD.D11
  Bottom 0.254: v63.5,10.54 63.88,10.16 63.88,5.97 59.94,2.03 v37.34,2.03
RESET  (via drill 0.5)
  Top 0.406: v2.92,10.29 2.92,7.18 SW2.1 | v16.51,45.21 28.72,45.21 30.23,46.72 D1.C 33.27,49.66 ARD.RESET
  Bottom 0.406: v2.92,10.29 2.92,31.62 v16.51,45.21
SCL
  Top 0.254: Q2.3 18.65,8.13 19.47,8.13 R12.1 19.3,7.79 ARD.SCL
SCL_3V  (via drill 0.5)
  Top 0.254: CONN1.4 10.39,7.38 R7.1 13.59,9.56 | IC2.12 33.1,36.77 33.86,37.53 33.86,39.18 33.08,39.95 29.02,39.95 27.78,41.2 v23.24,41.2 | v13.59,8.02 13.59,9.56 | 13.59,9.56 14.27,9.56 Q2.2
  Bottom 0.254: v23.24,41.2 23.24,40.04 22.48,39.28 22.48,23.37 13.59,14.48 v13.59,8.02
SCLK_3V  (via drill 0.5)
  Top 0.254: v29.97,31.24 29.72,31.5 27.75,31.5 U3.2 26.74,31.37 25.72,32.38 23.11,32.38 22,33.5 7.01,33.5 6.5,34.01 X1.5 | TFT1.37 41.82,32.93 40.13,31.24 v36.83,31.24
  Bottom 0.254: v36.83,31.24 v29.97,31.24
SCLK_5V  (via drill 0.5)
  Top 0.254: ICSP_CLK.1 58.93,16.51 | 58.93,16.51 SJ3.2 | 58.93,16.51 58.17,16.51 57.66,17.02 57.66,43.69 56.13,45.21 49.28,45.21 v48.01,46.48 | v25.15,31.5 25.15,31.24 26.16,30.23 27.3,30.23 27.43,30.1 U3.3
  Bottom 0.254: v48.01,46.48 46.23,48.26 31.24,48.26 24.77,41.78 24.77,31.88 v25.15,31.5
SDA  (via drill 0.5)
  Top 0.254: Q3.3 10.78,9 v10.67,8.89 | R11.1 v21.84,6.73 ARD.SDA
  Bottom 0.254: v21.84,6.73 21.72,6.6 12.95,6.6 v10.67,8.89
SDA_3V  (via drill 0.5)
  Top 0.254: R5.1 8.68,9.56 Q3.2 9.39,8.85 v9.39,7.75 CONN1.3 | IC2.11 33.11,37.42 33.27,37.59 33.27,38.99 32.77,39.5 28.57,39.5 27.69,40.39 22.1,40.39 v21.97,40.26
  Bottom 0.254: v21.97,40.26 21.84,40.13 21.84,24.98 8.76,11.89 8.76,8.38 v9.39,7.75
TFT_CS_3V  (via drill 0.5)
  Top 0.254: U3.10 33.91,25.02 35.18,26.29 v35.18,26.8 | TFT1.38 41.17,33.43 v40.13,32.38
  Bottom 0.254: v40.13,32.38 40.13,29.34 37.59,26.8 v35.18,26.8
TFT_CS_5V  (via drill 0.5)
  Top 0.254: ARD.D10 38.48,5.84 39.88,5.84 41.66,7.62 | 41.66,7.62 R10.1 | U3.9 34.54,23.75 v34.8,23.5 | v43.31,7.89 43.03,7.62 41.66,7.62
  Bottom 0.254: v34.8,23.5 36.7,21.59 36.7,12.83 41.63,7.89 v43.31,7.89
TFT_DC_3V  (via drill 0.5)
  Top 0.254: v29.59,26.92 29.59,26.8 29.53,26.8 29.02,26.29 U3.6 | TFT1.36 42.08,32.43 38.73,29.08 v38.48,29.08
  Bottom 0.254: v29.59,26.92 29.72,26.8 33.4,26.8 35.69,29.08 v38.48,29.08
TFT_DC_5V  (via drill 0.5)
  Top 0.254: v29.97,22.61 29.97,23.62 28.45,25.15 27.75,25.15 U3.7 | ARD.D9 39.62,3.43 v38.61,4.45
  Bottom 0.254: v29.97,22.61 31.75,22.61 34.54,19.81 34.54,8.26 38.35,4.45 v38.61,4.45
TFT_RST  (via drill 0.5)
  Top 0.203: IC1.2 31.55,42.91 32.45,42.01 34.67,42.01 35.24,42.58 U2.3
  Top 0.254: D1.A 31.75,44.72 31.24,44.21 v31.24,44.2 31.18,44.13 IC1.2 31.18,43.43 30.14,43.43 R6.1 | TFT1.10 43.81,19.43 v44.7,20.32
  Bottom 0.254: v44.7,20.32 47.5,23.11 47.5,42.67 46.61,43.56 31.88,43.56 v31.24,44.2
TS_INT  (via drill 0.39, 0.5)
  Top 0.254: IC2.10 31.63,38.07 30.74,38.96 28.32,38.96 27.54,39.75 24.26,39.75 v23.37,38.86 | v60.1,6.1 60.2,6.1 60.71,6.6 ICSP_SI1.1
  Bottom 0.254: v23.37,38.86 23.24,38.73 23.24,26.04 25.15,24.13 32,24.13 35.56,20.57 35.56,10.5 40.76,5.31 48.23,5.31 49.9,6.99 59.21,6.99 v60.1,6.1
TSC_PWR
  Top 0.203: 38.13,34.08 IC2.1
  Top 0.254: U2.5 37.53,39.18 37.21,38.86 37.21,34.54 37.59,34.16 38.05,34.16 38.13,34.08 38.13,33.6 C9.1
  Top 0.406: U2.5 37.68,40.13 C8.1
VDDIO  (via drill 0.5)
  Top 0.254: R8.2 50.34,8.85 R9.2 49.66,9.18 41.83,9.18 R10.2 39.41,7.11 25.4,7.11 22.77,9.74 R11.2 R12.2 19.56,21.97 19.18,22.35 v19.18,25.78 | ARD.IOREF 30.48,53.21 18.8,53.21 18.54,52.96 VIO.2 18.67,51.44 v18.67,49.28
  Bottom 0.254: v19.18,25.78 19.18,48.77 v18.67,49.28
XL
  Top 0.254: TFT1.46 40.6,37.43 39.3,36.12 IC2.4
XR
  Top 0.254: TFT1.44 41.12,36.42 39.52,34.82 IC2.2
YD
  Top 0.254: TFT1.45 40.87,36.93 39.41,35.47 IC2.3
YU
  Top 0.254: TFT1.47 40.34,37.93 39.19,36.77 IC2.5

### Text on the board
Pinguin_tBackup: VddIO | 3V | 5V | 2.8" TFT LCD shield | w/Touchscreen | TFT: ILI9341 SPI / TS: TSC2007 I2C | and microSD card | ADDR0 | ADDR1 | TFT CS #10 / TFT DC #9 / Card CS #4 / / Touchscreen / I2C Addr 0x48 / Pen IRQ #2 | ICSP | SCK | SO | SI | 13 | 11 | LITE | No ICSP Header? / Cut & solder 11-13 | TSIRQ | #2 | STEMMA / QT | #3 | Reset